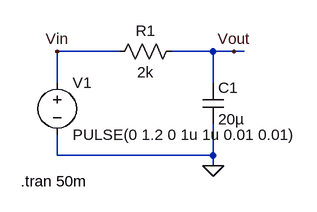
[diagram p0: schematic exm.asc]
exm.asc, the LTspice schematic file:
Version 4
SHEET 1 880 680
WIRE 112 96 16 96
WIRE 256 96 192 96
WIRE 288 96 256 96
WIRE 304 96 288 96
WIRE 16 144 16 96
WIRE 256 144 256 96
WIRE 16 256 16 224
WIRE 256 256 256 208
WIRE 256 256 16 256
WIRE 256 272 256 256
FLAG 256 272 0
FLAG 288 96 Vout
FLAG 16 96 Vin
SYMBOL voltage 16 128 R0
WINDOW 123 0 0 Left 0
WINDOW 39 0 0 Left 0
SYMATTR InstName V1
SYMATTR Value PULSE(0 1.2 0 1u 1u 0.01 0.01)
SYMBOL res 208 80 R90
WINDOW 0 0 56 VBottom 2
WINDOW 3 32 56 VTop 2
SYMATTR InstName R1
SYMATTR Value 2k
SYMBOL cap 240 144 R0
SYMATTR InstName C1
SYMATTR Value 20µ
TEXT -40 296 Left 2 !.tran 50m

The netlist it stands for:
* exm.asc
V1 Vin 0 PULSE(0 1.2 0 1u 1u 0.01 0.01)
R1 Vout Vin 2k
C1 Vout 0 20µ
.tran 50m
.backanno
.end